# EAGLE design revB (EAGLE 6.3)

## Sheet 1 of 4: MCU
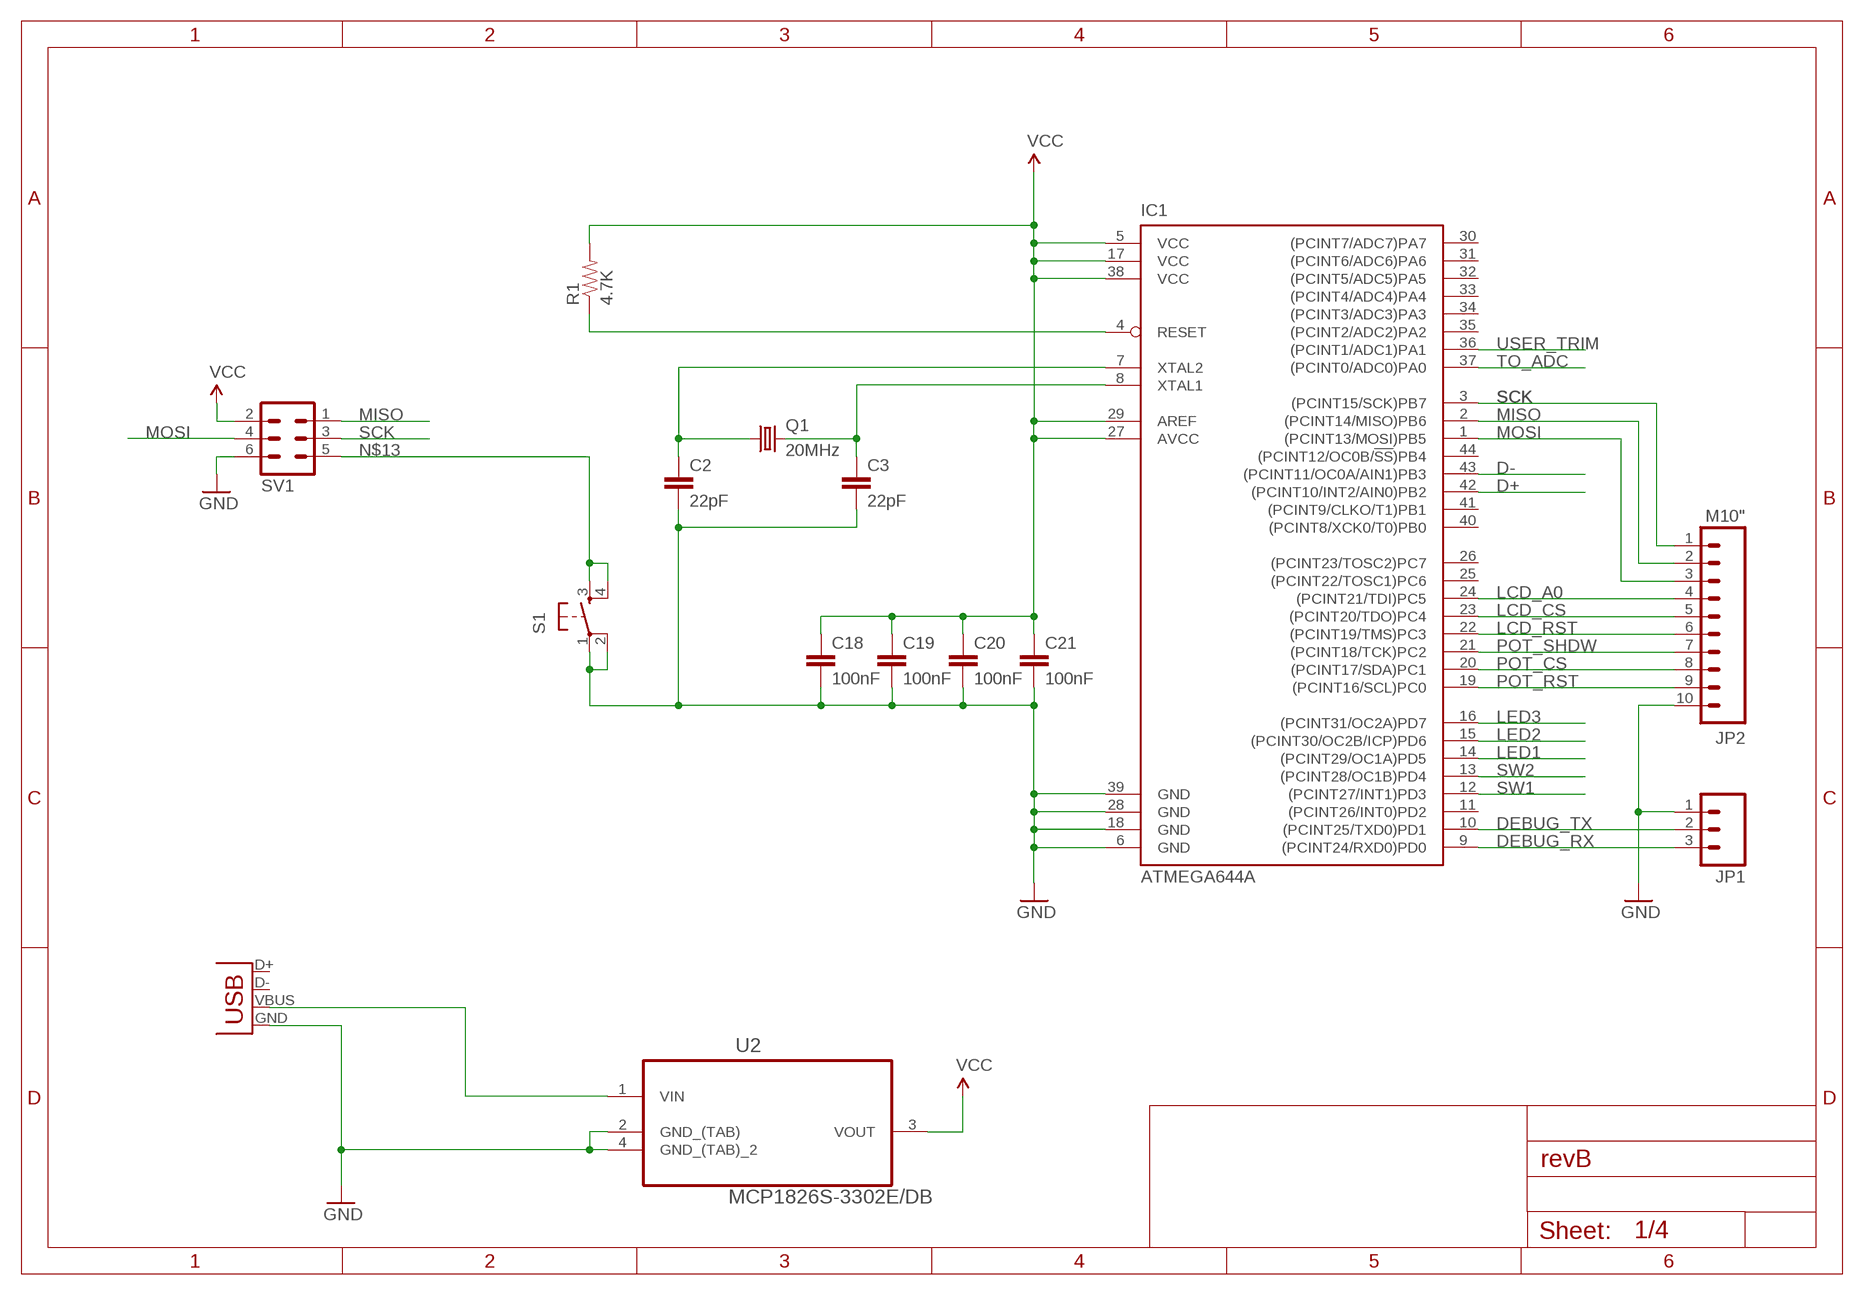
[diagram p0: schematic, sheet 1]

### Parts
C2  22pF  CAP0805  [0805]
C3  22pF  CAP0805  [0805]
C18  100nF  CAP0805  [0805]
C19  100nF  CAP0805  [0805]
C20  100nF  CAP0805  [0805]
C21  100nF  CAP0805  [0805]
IC1  ATMEGA644A  [TQFP44]
JP1  M03PTH  [1X03]
JP2  M10"  [1X10]
Q1  20MHz  CRYSTALHC49UV  [HC49U-V]
R1  4.7K  RESISTOR1206  [1206]
S1  TAC_SWITCHPTH  [TACTILE-PTH]
SV1  MA03-2  [MA03-2]
U2  MCP1826S-3302E/DB  [SOT230P700X180-4N]
X2  USB-MB-H  [USB-MB-H]

### Nets
D+: IC1.42((PCINT10/INT2/AIN0)PB2)
D-: IC1.43((PCINT11/OC0A/AIN1)PB3)
DEBUG_RX: IC1.9((PCINT24/RXD0)PD0) JP1.3
DEBUG_TX: IC1.10((PCINT25/TXD0)PD1) JP1.2
GND: C2.2 C3.2 C18.2 C19.2 C20.2 C21.2 IC1.6(GND) IC1.18(GND) IC1.28(GND) IC1.39(GND) JP1.1 JP2.10 S1.1 S1.2 SV1.6 U2.2(GND_(TAB)) U2.4(GND_(TAB)_2) X2.GND ; also sheet 2,3,4
LCD_A0: IC1.24((PCINT21/TDI)PC5) JP2.4 ; also sheet 3
LCD_CS: IC1.23((PCINT20/TDO)PC4) JP2.5 ; also sheet 3
LCD_RST: IC1.22((PCINT19/TMS)PC3) JP2.6 ; also sheet 3
LED1: IC1.14((PCINT29/OC1A)PD5) ; also sheet 4
LED2: IC1.15((PCINT30/OC2B/ICP)PD6) ; also sheet 4
LED3: IC1.16((PCINT31/OC2A)PD7) ; also sheet 4
MISO: IC1.2((PCINT14/MISO)PB6) JP2.2 SV1.1 ; also sheet 2
MOSI: IC1.1((PCINT13/MOSI)PB5) JP2.3 SV1.4 ; also sheet 2,3
N$1: C3.1 IC1.8(XTAL1) Q1.2
N$2: C2.1 IC1.7(XTAL2) Q1.1
N$13: S1.3 S1.4 SV1.5
N$20: U2.1(VIN) X2.VBUS
POT_CS: IC1.20((PCINT17/SDA)PC1) JP2.8 ; also sheet 2
POT_RST: IC1.19((PCINT16/SCL)PC0) JP2.9 ; also sheet 2
POT_SHDW: IC1.21((PCINT18/TCK)PC2) JP2.7 ; also sheet 2
RESET: IC1.4(RESET) R1.1
SCK: IC1.3((PCINT15/SCK)PB7) JP2.1 SV1.3 ; also sheet 2,3
SW1: IC1.12((PCINT27/INT1)PD3) ; also sheet 4
SW2: IC1.13((PCINT28/OC1B)PD4) ; also sheet 4
TO_ADC: IC1.37((PCINT0/ADC0)PA0) ; also sheet 2
USER_TRIM: IC1.36((PCINT1/ADC1)PA1) ; also sheet 4
VCC: C18.1 C19.1 C20.1 C21.1 IC1.5(VCC) IC1.17(VCC) IC1.27(AVCC) IC1.29(AREF) IC1.38(VCC) R1.2 SV1.2 U2.3(VOUT) ; also sheet 2,3,4
Unconnected: IC1.11((PCINT26/INT0)PD2) IC1.25((PCINT22/TOSC1)PC6) IC1.26((PCINT23/TOSC2)PC7) IC1.30((PCINT7/ADC7)PA7) IC1.31((PCINT6/ADC6)PA6) IC1.32((PCINT5/ADC5)PA5) IC1.33((PCINT4/ADC4)PA4) IC1.34((PCINT3/ADC3)PA3) IC1.35((PCINT2/ADC2)PA2) IC1.40((PCINT8/XCK0/T0)PB0) IC1.41((PCINT9/CLKO/T1)PB1) IC1.44((PCINT12/OC0B/!SS!)PB4) X2.D+ X2.D-

## Sheet 2 of 4: Analogue Input Stage
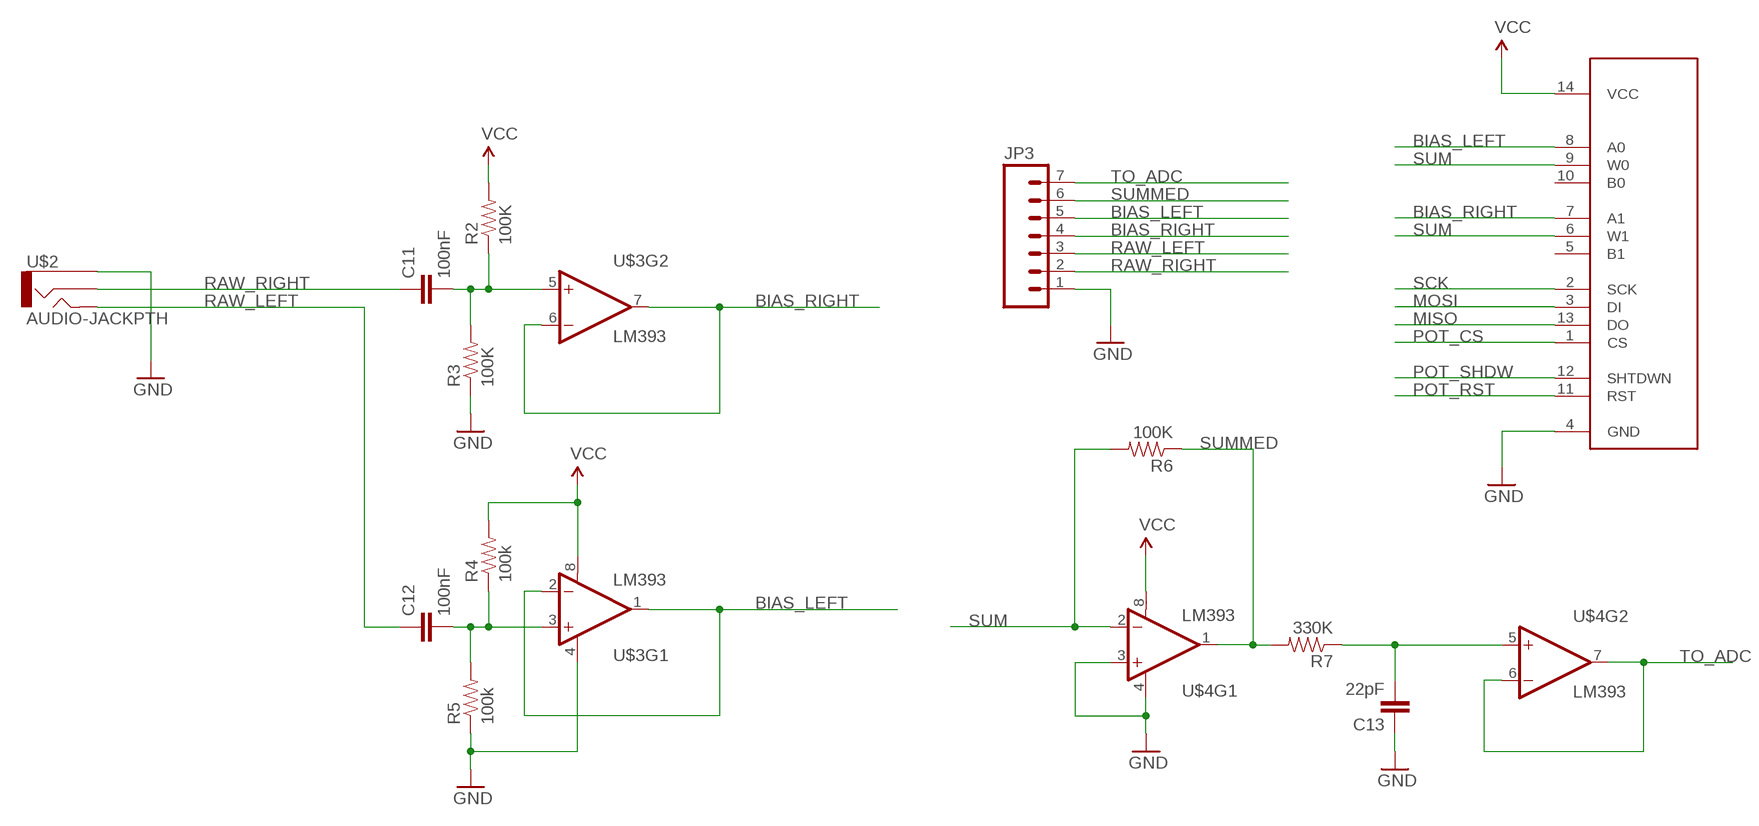
[diagram p1: schematic, sheet 2]

### Parts
C11  100nF  CAP0805  [0805]
C12  100nF  CAP0805  [0805]
C13  22pF  CAP0805  [0805]
JP3  M07  [1X07]
R2  100K  RESISTOR1206  [1206]
R3  100K  RESISTOR1206  [1206]
R4  100k  RESISTOR1206  [1206]
R5  100k  RESISTOR1206  [1206]
R6  100K  RESISTOR1206  [1206]
R7  330K  RESISTOR1206  [1206]
U1  MCP42XXX  [SO014]
U$2  AUDIO-JACKPTH  [AUDIO-JACK]
U$3  LM393  [SO08]
U$4  LM393  [SO08]

### Nets
BIAS_LEFT: JP3.5 U1.8(A0) U$3.1(OUT) U$3.2(-IN)
BIAS_RIGHT: JP3.4 U1.7(A1) U$3.6(-IN) U$3.7(OUT)
GND: C13.1 JP3.1 R3.1 R5.1 U1.4(GND) U$2.1 U$3.4(V-) U$4.3(+IN) U$4.4(V-) ; also sheet 1,3,4
MISO: U1.13(DO) ; also sheet 1
MOSI: U1.3(DI) ; also sheet 1,3
N$15: C11.2 R2.1 R3.2 U$3.5(+IN)
N$16: C12.2 R4.1 R5.2 U$3.3(+IN)
N$17: C13.2 R7.1 U$4.5(+IN)
POT_CS: U1.1(CS) ; also sheet 1
POT_RST: U1.11(RST) ; also sheet 1
POT_SHDW: U1.12(SHTDWN) ; also sheet 1
RAW_LEFT: C12.1 JP3.3 U$2.5
RAW_RIGHT: C11.1 JP3.2 U$2.2
SCK: U1.2(SCK) ; also sheet 1,3
SUM: R6.2 U1.6(W1) U1.9(W0) U$4.2(-IN)
SUMMED: JP3.6 R6.1 R7.2 U$4.1(OUT)
TO_ADC: JP3.7 U$4.6(-IN) U$4.7(OUT) ; also sheet 1
VCC: R2.2 R4.2 U1.14(VCC) U$3.8(V+) U$4.8(V+) ; also sheet 1,3,4
Unconnected: U1.5(B1) U1.10(B0)

## Sheet 3 of 4: Screen
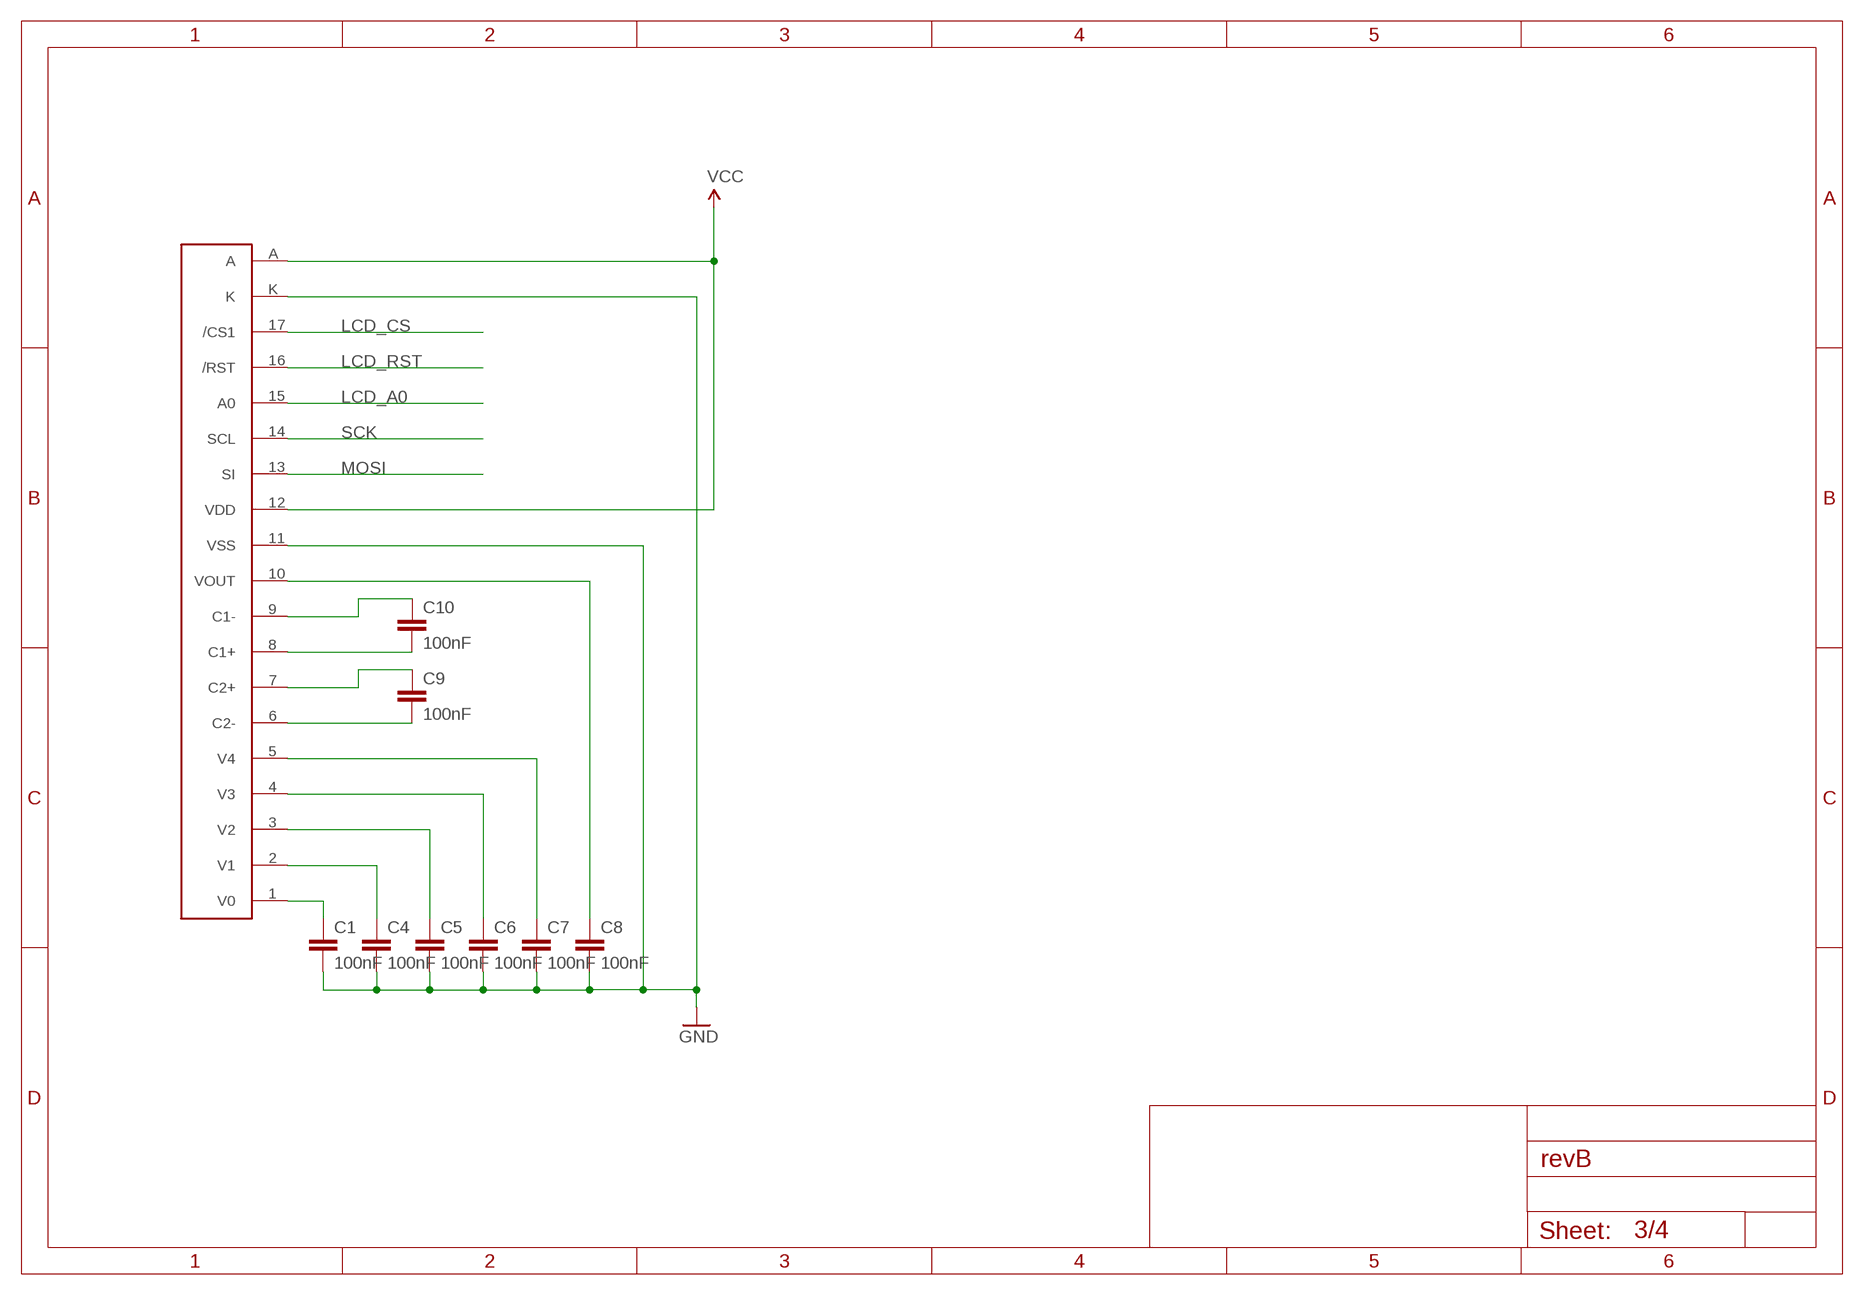
[diagram p2: schematic, sheet 3]

### Parts
C1  100nF  CAP0805  [0805]
C4  100nF  CAP0805  [0805]
C5  100nF  CAP0805  [0805]
C6  100nF  CAP0805  [0805]
C7  100nF  CAP0805  [0805]
C8  100nF  CAP0805  [0805]
C9  100nF  CAP0805  [0805]
C10  100nF  CAP0805  [0805]
U$1  NHD_128X32  [NHD_128X32]

### Nets
GND: C1.2 C4.2 C5.2 C6.2 C7.2 C8.2 U$1.11(VSS) U$1.K ; also sheet 1,2,4
LCD_A0: U$1.15(A0) ; also sheet 1
LCD_CS: U$1.17(/CS1) ; also sheet 1
LCD_RST: U$1.16(/RST) ; also sheet 1
MOSI: U$1.13(SI) ; also sheet 1,2
N$3: C9.2 U$1.6(C2-)
N$4: C9.1 U$1.7(C2+)
N$5: C10.2 U$1.8(C1+)
N$6: C10.1 U$1.9(C1-)
N$7: C1.1 U$1.1(V0)
N$8: C4.1 U$1.2(V1)
N$9: C5.1 U$1.3(V2)
N$10: C6.1 U$1.4(V3)
N$11: C7.1 U$1.5(V4)
N$12: C8.1 U$1.10(VOUT)
SCK: U$1.14(SCL) ; also sheet 1,2
VCC: U$1.12(VDD) U$1.A ; also sheet 1,2,4

## Sheet 4 of 4: MISC
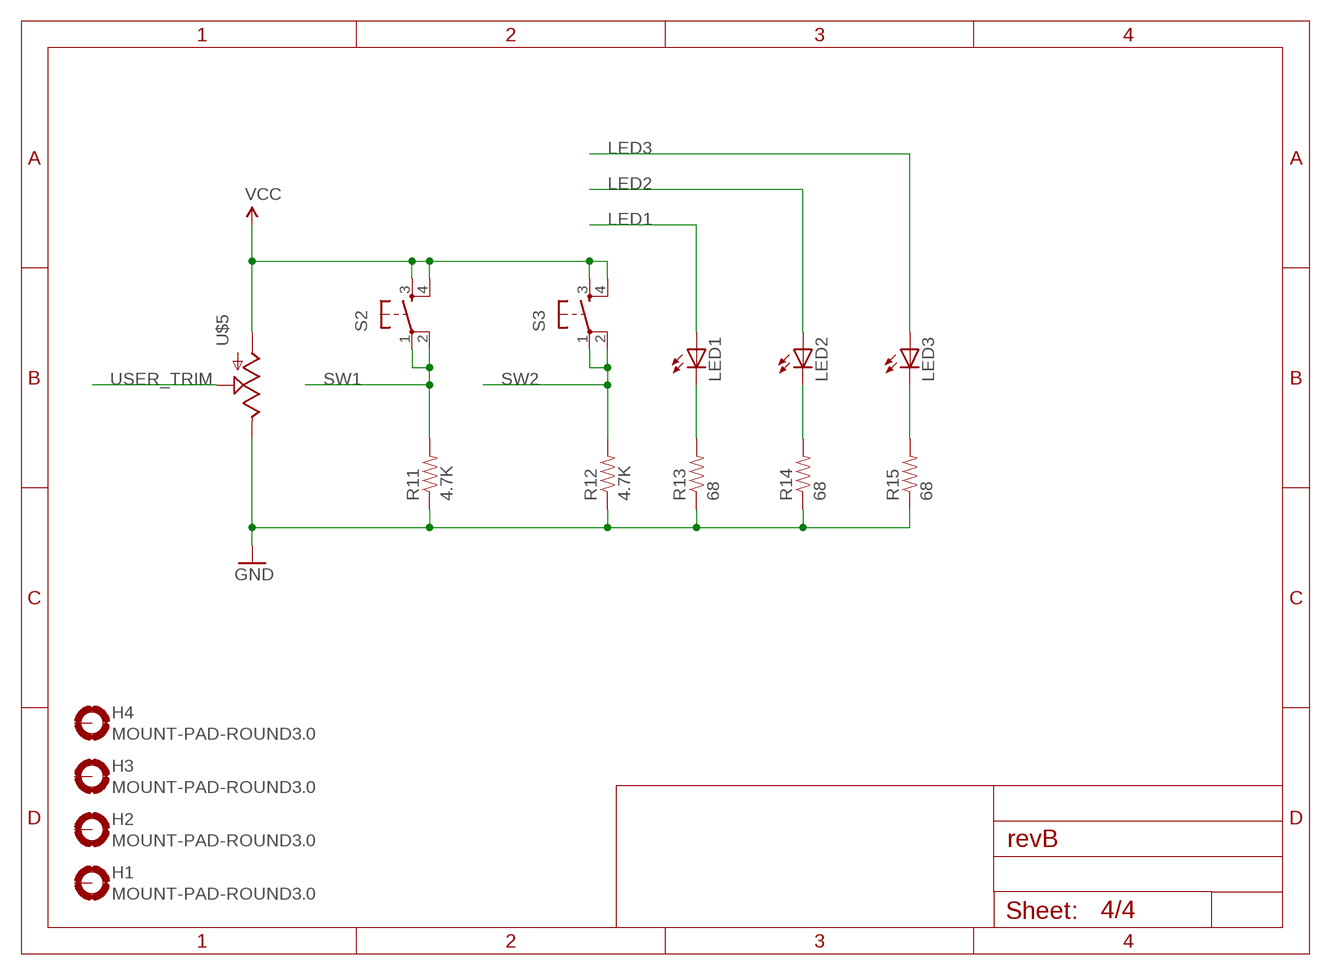
[diagram p3: schematic, sheet 4]

### Parts
H1  MOUNT-PAD-ROUND3.0  [3,0-PAD]
H2  MOUNT-PAD-ROUND3.0  [3,0-PAD]
H3  MOUNT-PAD-ROUND3.0  [3,0-PAD]
H4  MOUNT-PAD-ROUND3.0  [3,0-PAD]
LED1  LED1206  [LED-1206]
LED2  LED1206  [LED-1206]
LED3  LED1206  [LED-1206]
R11  4.7K  RESISTOR1206  [1206]
R12  4.7K  RESISTOR1206  [1206]
R13  68  RESISTOR1206  [1206]
R14  68  RESISTOR1206  [1206]
R15  68  RESISTOR1206  [1206]
S2  TAC_SWITCHPTH  [TACTILE-PTH]
S3  TAC_SWITCHPTH  [TACTILE-PTH]
U$5  POTTRIM  [TRIM_POT]

### Nets
GND: R11.1 R12.1 R13.1 R14.1 R15.1 U$5.2(E) ; also sheet 1,2,3
LED1: LED1.A ; also sheet 1
LED2: LED2.A ; also sheet 1
LED3: LED3.A ; also sheet 1
N$22: LED1.C R13.2
N$23: LED2.C R14.2
N$24: LED3.C R15.2
SW1: R11.2 S2.1 S2.2 ; also sheet 1
SW2: R12.2 S3.1 S3.2 ; also sheet 1
USER_TRIM: U$5.1(S) ; also sheet 1
VCC: S2.3 S2.4 S3.3 S3.4 U$5.3(A) ; also sheet 1,2,3
Unconnected: H1.B3,0(MOUNT) H2.B3,0(MOUNT) H3.B3,0(MOUNT) H4.B3,0(MOUNT)

## Library data of the parts
C1-C13 C18-C21 = SparkFun:CAP: Capacitor Standard 0603 ceramic capacitor, and 0.1" leaded capacitor.
H1-H4 = holes:MOUNT-PAD-ROUND: MOUNTING PAD, round
IC1 = atmel:ATMEGA644: 8-bit Microcontroller with 64K Bytes In-System Programmable Flash Source: http://www.atmel.com/dyn/resources/prod_documents/doc2593.pdf; MPN: ATMEGA644PV-10AU; OC_FARNELL: 1455123; OC_NEWARK: 58M3748
JP1 = SparkFun-Connectors:M03: Header 3 Standard 3-pin 0.1" header. Use with straight break away headers (SKU : PRT-00116), right angle break away headers (PRT-00553), swiss pins (PRT-00743), machine pins (PRT-00117), and female headers (PRT-00115). Molex polarized connector foot print use with SKU : PRT-08232 with associated crimp pins and housings.
JP2 = SparkFun-Connectors:M10: Header 10 Standard 10-pin 0.1" header. Use with straight break away headers (SKU : PRT-00116), right angle break away headers (PRT-00553), swiss pins (PRT-00743), machine pins (PRT-00117), and female headers (PRT-00115).
JP3 = SparkFun-Connectors:M07: Header 7 Standard 7-pin 0.1" header. Use with straight break away headers (SKU : PRT-00116), right angle break away headers (PRT-00553), swiss pins (PRT-00743), machine pins (PRT-00117), and female headers (PRT-00115). NOTES ON THE VARIANTS LOCK and LOCK_LONGPADS... This footprint was designed to help hold the alignment of a through-hole component (i.e. 7-pin header) while soldering it into place. You may notice that each hole has been shifted either up or down by 0.005 of an inch from it's more standard position (which is usually a perfectly straight line). This slight alteration caused the pins (the squares in the middle) to touch the edges of the holes. Because they are alternating, it causes a "brace" to hold the header in place. 0.005 has proven to be the perfect amount of "off-center" position when using our standard breakaway headers. Although looks a little odd when you look at the bare footprint, once you have a header in there, the alteration is very hard to notice. Also, if you push a header all the way into place, it is covered up entirely on the bottom side. This idea of altering the position of holes to aid alignment will be further integrated into the Sparkfun Library for other footprints. It can help hold any component with 3 or more connection pins.
LED1-LED3 = SparkFun:LED: LEDs Standard schematic elements and footprints for 5mm, 3mm, 1206, and 0603 sized LEDs. 5mm - Spark Fun Electronics SKU : COM-00529 (and others)
Q1 = SparkFun:CRYSTAL: Crystals Various standard crystals. Proven footprints. Spark Fun Electronics SKU : COM-00534
R1-R7 R11-R15 = SparkFun:RESISTOR: Resistor Basic schematic elements and footprints for 0603, 1206, and PTH 1/10th watt (small) resistors.
S1-S3 = SparkFun:TAC_SWITCH: Momentary Switch Button commonly used for reset or general input. Spark Fun Electronics SKU : COM-00097
SV1 = con-lstb:MA03-2: PIN HEADER; OC_FARNELL: unknown; OC_NEWARK: unknown
U1 = SparkFun:MCP42XXX
U2 = MCP1826S:MCP1826S-3302E/DB: IC, LDO, 3.3V, 1A; MPN: MCP1826S-3302E/DB; OC_FARNELL: 1578424; OC_NEWARK: 27M0037; PACKAGE: SOT-223-3; SUPPLIER: Microchip
U$1 = newhaven:NHD_128X32
U$2 = SparkFun:AUDIO-JACK: 3.5mm Audio Jack Simple 3.5mm common PCB mount audio jack. SKU: PRT-08032
U$3 U$4 = SparkFun:LM393
U$5 = SparkFun:POT
X2 = SparkFun:USB: USB Connectors USB-B-PTH is fully proven SKU : PRT-00139 USB-miniB is fully proven SKU : PRT-00587 USB-A-PCB is untested. USB-A-H is throughly reviewed, but untested. Spark Fun Electronics SKU : PRT-00437 USB-B-SMT is throughly reviewed, but untested. Needs silkscreen touching up. USB-A-S has not been used/tested USB-MB-H has not been used/tested

## Board
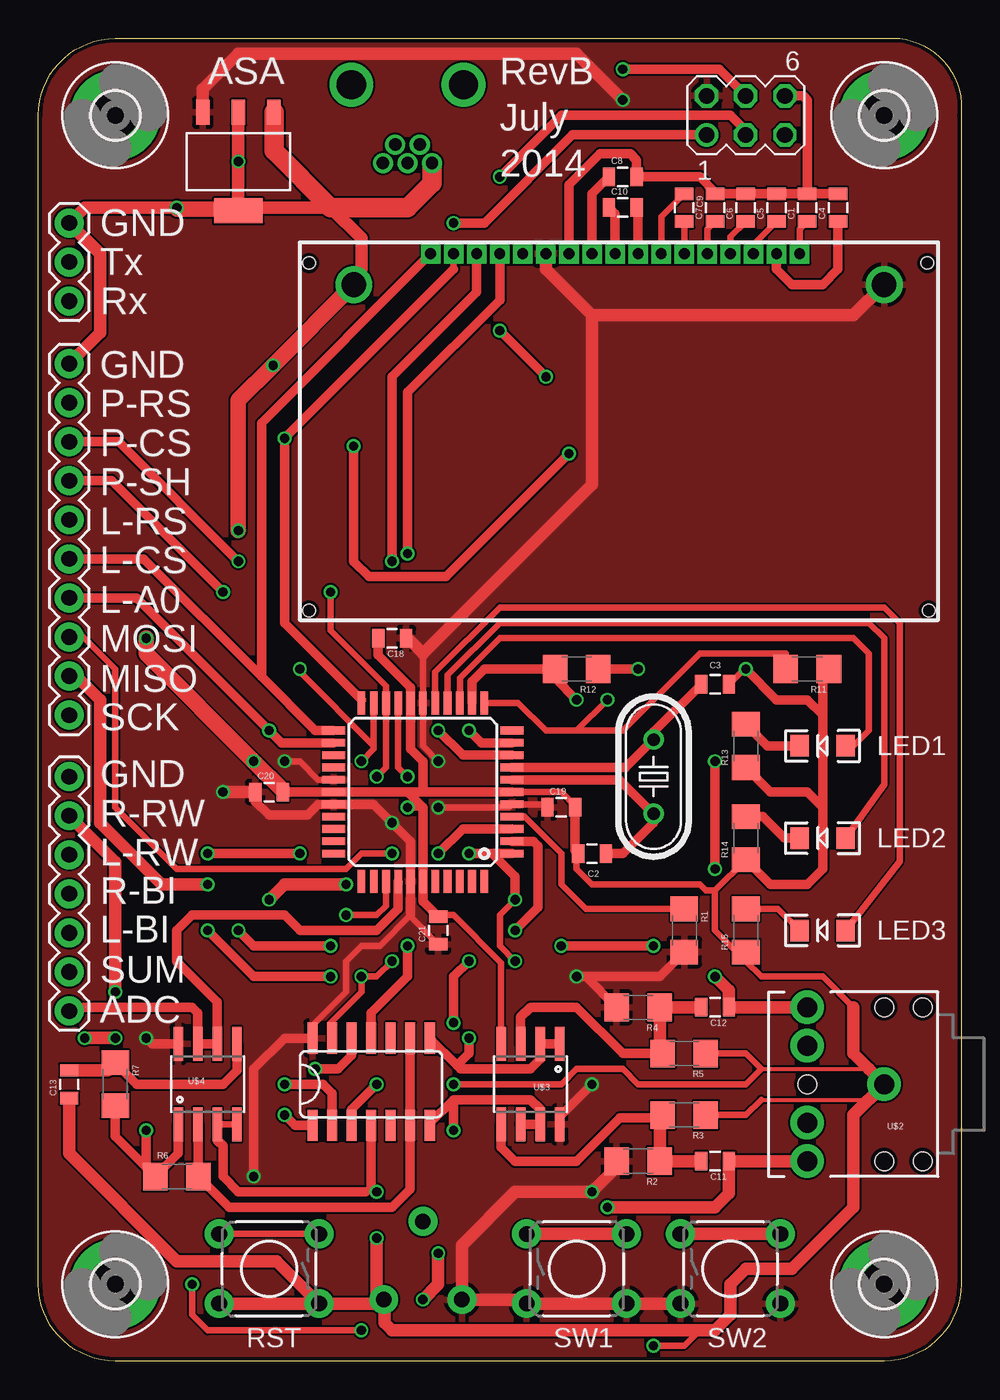
[diagram p4: board, top side]
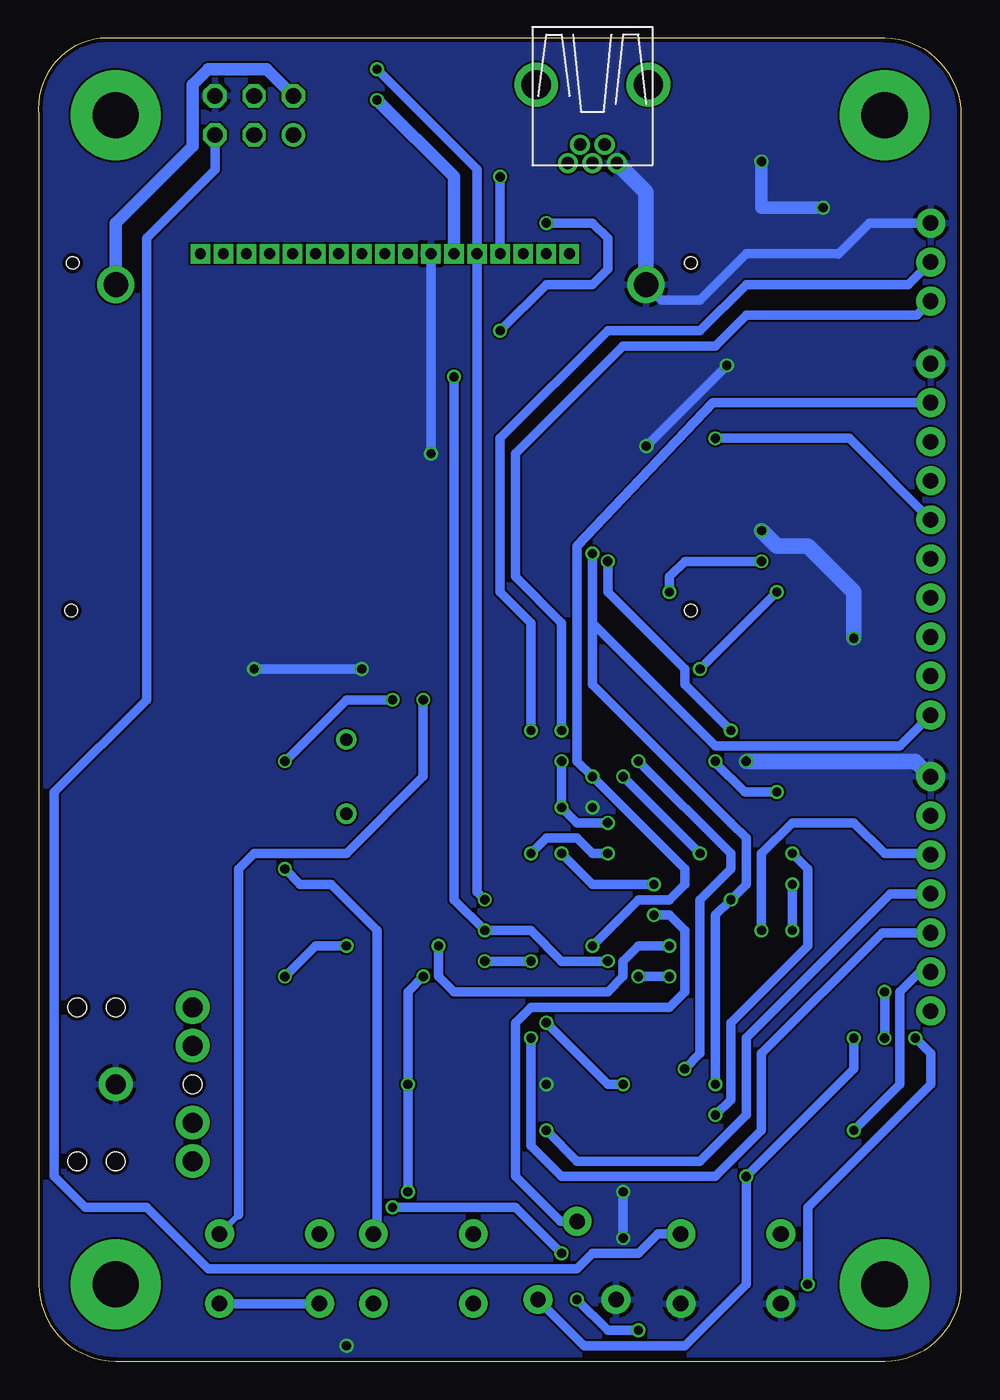
[diagram p5: board, bottom side, seen from below]

Size 60.03 x 86 mm. Coordinates in mm from the lower left corner, seen from the top.
Outline: 0,5 0,81 arc-90 5,86 56,86 arc-90 60,81 60,5 arc-90 55,0 5,0 arc-90 0,5
Copper layers (1*16): Top 0.035mm / dielectric 1.5mm / Bottom 0.035mm
Design rules "dirt_cheap_dirty_boards.v1": minimum track width 5mil, minimum drill 12mil, track to track 5mil, track to pad 5mil, pad to pad 5mil, via to via 5mil, smd to smd 0mil, copper to edge 10mil, drill to drill 10mil, minimum pad ring 10mil, minimum via ring 6mil, stop-mask expansion 2mil, vias tented up to drill 25mil, thermal gap 10mil

### Footprints (pad centres in the part's own frame; a part is rotated, then mirrored left to right if it is on the bottom)
0805 = smd 0.8 x 1.2: 1 -0.9,0; 2 0.9,0
3,0-PAD = drill 3 pad 5.842: B3,0 0,0
TQFP44 = smd 1.5 x 0.5: 1 -5.8,4; 2 -5.8,3.2; 3 -5.8,2.4; 4 -5.8,1.6; 5 -5.8,0.8; 6 -5.8,0; 7 -5.8,-0.8; 8 -5.8,-1.6; 9 -5.8,-2.4; 10 -5.8,-3.2; 11 -5.8,-4; 23 5.8,-4; 24 5.8,-3.2; 25 5.8,-2.4; 26 5.8,-1.6; 27 5.8,-0.8; 28 5.8,0; 29 5.8,0.8; 30 5.8,1.6; 31 5.8,2.4; 32 5.8,3.2; 33 5.8,4 | smd 0.5 x 1.5: 12 -4,-5.8; 13 -3.2,-5.8; 14 -2.4,-5.8; 15 -1.6,-5.8; 16 -0.8,-5.8; 17 0,-5.8; 18 0.8,-5.8; 19 1.6,-5.8; 20 2.4,-5.8; 21 3.2,-5.8; 22 4,-5.8; 34 4,5.8; 35 3.2,5.8; 36 2.4,5.8; 37 1.6,5.8; 38 0.8,5.8; 39 0,5.8; 40 -0.8,5.8; 41 -1.6,5.8; 42 -2.4,5.8; 43 -3.2,5.8; 44 -4,5.8
1X03 = drill 1.016 pad 1.88: 1 0,0; 2 2.54,0; 3 5.08,0
1X10 = drill 1.016 pad 1.88: 1 0,0; 2 2.54,0; 3 5.08,0; 4 7.62,0; 5 10.16,0; 6 12.7,0; 7 15.24,0; 8 17.78,0; 9 20.32,0; 10 22.86,0
1X07 = drill 1.016 pad 1.88: 1 0,0; 2 2.54,0; 3 5.08,0; 4 7.62,0; 5 10.16,0; 6 12.7,0; 7 15.24,0
LED-1206 = smd 1.2 x 1.4: A -1.5,0; C 1.5,0
HC49U-V = drill 0.813: 1 -2.413,0; 2 2.413,0
1206 = smd 1.6 x 1.8: 1 -1.4,0; 2 1.4,0
TACTILE-PTH = drill 1.016 pad 1.88: 1 -3.251,2.261; 2 3.251,2.261; 3 -3.251,-2.261; 4 3.251,-2.261
MA03-2 = drill 1.016: 1 -2.54,-1.27 | drill 1.016 octagon: 2 -2.54,1.27; 3 0,-1.27; 4 0,1.27; 5 2.54,-1.27; 6 2.54,1.27
SO014 = smd 0.66 x 2.032: 1 -3.175,-2.68; 2 -1.905,-2.68; 3 -0.635,-2.68; 4 0.635,-2.68; 5 1.905,-2.68; 6 3.175,-2.68; 7 4.445,-2.68; 8 4.445,2.997; 9 3.175,2.997; 10 1.905,2.997; 11 0.635,2.997; 12 -0.635,2.997; 13 -1.905,2.997; 14 -3.175,2.997
SOT230P700X180-4N = smd 1.626 x 0.889: 1 -3.2,2.311; 2 -3.2,0; 3 -3.2,-2.311 | smd 1.626 x 3.175: 4 3.2,0
NHD_128X32 = drill 0.7 pad 1.27 square: 1 32.5,24; 2 31,24; 3 29.5,24; 4 28,24; 5 26.5,24; 6 25,24; 7 23.5,24; 8 22,24; 9 20.5,24; 10 19,24; 11 17.5,24; 12 16,24; 13 14.5,24; 14 13,24; 15 11.5,24; 16 10,24; 17 8.5,24 | drill 1.6: A 37.999,21.992; K 3.508,21.99 | hole 0.8: 0.6,23.4; 0.6,0.8; 40.9,0.8; 40.8,23.4
AUDIO-JACK = drill 1.3 pad 2.184: 1 0,0; 2 5,5; 3 5,2.5; 4 5,-2.5; 5 5,-5 | hole 1.2: 0,5; -2.5,5; -2.5,-5; 0,-5; 5,0
SO08 = smd 0.61 x 2.21: 1 -1.905,-2.616; 2 -0.635,-2.616; 3 0.635,-2.616; 4 1.905,-2.616; 5 1.905,2.616; 6 0.635,2.616; 7 -0.635,2.616; 8 -1.905,2.616
TRIM_POT = drill 1 pad 1.88: 1 5.08,0; 2 0,2.54; 3 0,-2.54
USB-MB-H = drill 0.8: D+ 5.1,0; D- 3.9,0.8; GND 5.1,-1.6; ID 3.9,-0.8; VBUS 5.1,1.6 | drill 1.9: P$6 0,-3.65; P$7 0,3.65

### Placement (x,y rotation side)
C1  50,75 90 top
C2  36,33 180 top
C3  44,44 0 top
C4  52,75 90 top
C5  48,75 90 top
C6  46,75 90 top
C7  44,75 90 top
C8  38,77 0 top
C9  42,75 270 top
C10  38,75 0 top
C11  44,13 180 top
C12  44,23 180 top
C13  2,18 90 top
C18  23,47 180 top
C19  34,36 0 top
C20  15,37 0 top
C21  26,28 90 top
H1  5,5 0 top
H2  55,5 0 top
H3  5,81 0 top
H4  55,81 0 top
IC1  25,37 180 top
JP1  2,74 270 top
JP2  2,42 90 top
JP3  2,38 270 top
LED1  51,40 180 top
LED2  51,34 180 top
LED3  51,28 180 top
Q1  40,38 90 top
R1  42,28 270 top
R2  39,13 180 top
R3  42,16 180 top
R4  39,23 180 top
R5  42,20 180 top
R6  9,12 0 top
R7  5,18 270 top
R11  50,45 180 top
R12  35,45 180 top
R13  46,40 90 top
R14  46,34 90 top
R15  46,28 90 top
S1  15,6 180 top
S2  35,6 0 top
S3  45,6 0 top
SV1  46,81 0 top
U1  21,18 0 top
U2  13,78 270 top
U$1  17,48 0 top
U$2  55,18 180 top
U$3  32,18 180 top
U$4  11,18 0 top
U$5  25,4 90 top
X2  24,83 270 top

### Tracks (layer width: path | path; a pad name or v marks a point on that pad's centre or on a via)
BIAS_LEFT  (via drill 0.6)
  Top 0.406: U$3.1 33.91,19.91
  Top 0.61: U$3.1 U$3.2 32.63,19.64 32,19 27.44,19 27.22,19.22 | 27.22,19.22 U1.8 | v28,21 28,20 27.22,19.22
  Bottom 0.61: JP3.5 5.16,27.84 13,20 13,15 16,12 26,12 28,14 v28,21
BIAS_RIGHT  (via drill 0.6)
  Top 0.406: U$3.7 32.63,16.36 | U1.7 25.45,15.45
  Top 0.61: U$3.6 U$3.7 | 32.63,16.36 32,17 27,17 | 25.45,15.45 27,17 | v27,15 27,17
  Bottom 0.61: v27,15 25,13 17,13 14,16 14,21 4.62,30.38 JP3.4
DEBUG_RX  (via drill 0.6)
  Top 0.61: IC1.9 27.6,39.4 v26,41
  Bottom 0.61: JP1.3 2.92,68 14,68 16,66 22,66 29,59 29,51 26,48 v26,41
DEBUG_TX  (via drill 0.6)
  Top 0.61: v28,41 28.8,40.2 IC1.10
  Bottom 0.61: JP1.2 3.46,70 14,70 17,67 23,67 30,60 30,50 28,48 v28,41
GND  (via drill 0.6)
  Top 0.254: 47,19 54,19 | 47,17 54,17
  Top 0.406: R5.1 46,20 47,19 46,18 39,18 38,19 35,19 34,18 v27,18 | R3.1 46,16 47,17 | 54,17 U$2.1 | U$4.4 U$4.3 11.63,14.37 | IC1.6 34,37 34.9,36.1 C19.2 | 34.9,33.2 C2.2 35,32.9 35,32 36,31 43,31 43.4,30.6 44,30.6 | U$3.4 30.09,25.91 27,29 26.1,29 C21.2 | C20.2 15.9,37.1 | 21.27,11 21.64,11.37 | C7.2 44,76 | 53,23 51,25 47,25 46,26 R15.1 45.4,26.6 44,28 44,30.6 | 44,30.6 R14.1 | R11.1 51,44.6 | C3.2 45.9,45 v46,45 | v40,1 42,1 43,2 | v24,36 25,36
  Top 0.61: 24,37 IC1.28 C20.2 | 24,37 25,37 | 25,37 IC1.6 | 24,37 25,36 IC1.39 25,29.9 C21.2 | C19.2 34.9,33.2 | R12.1 v39,45 | 21.27,11 13,11 12,12 12,14 11.63,14.37 | 25,37 25,39 24.2,39.8 IC1.18 24.2,43.8 22.1,45.9 C18.2 | U1.4 21.64,11.37 v22,11 | 44,76 43,77 C8.2 38.9,78.1 38.5,78.5 36.5,78.5 34.5,76.5 U$1.11 | C7.2 C6.2 C5.2 C1.2 | C1.2 C4.2 | SV1.6 49.73,82.27 50,82 C1.2 | R14.1 47.6,31 50,31 51,32 51,36 | 51,44.6 51,42 | 51,42 51,36 | R13.1 47.6,37 50,37 51,36 | v46,45 48,43 50,43 51,42 | v34.5,59 26.5,51 21.5,51 20.5,52 v20.5,59.5 | 22.2,3.74 U$5.2 22.5,3.96
  Top 0.813: C13.1 2,13.5 9,6.5 15.49,6.5 S1.1 | JP2.10 4,66.86 4,72 JP1.1 3,75 v9,75 | 13,75 U2.4 9,74.8 v9,75 | 13,75 v13,78 U2.2 | 53,23 53,20 54,19 U$2.1 53,16 53,10 49,6 46,6 45,5 45,3 44,2 43,2 23,2 22.5,2.5 22.5,3.96 | S1.1 S1.2 | S1.1 22.2,3.74 | v22,8 22,4.46 U$5.2 | v9,75 13,75 | 13,75 19,75 21,73 21,71 20,70 21,70
  Top 1.016: v7,47 7,46 v14,39 15.9,37.1 | U$1.K v15.26,64.74 13,62.48 v13,54
  Bottom 0.406: 8.01,71.99 8.02,72 | v15.26,64.74
  Bottom 0.61: v39,45 v46,45 | 8.01,71.99 6,74 JP1.1 | v22,11 v22,8 | 8.02,72 14,72 17,69 19.52,69 U$1.K | v15.26,64.74 v20.5,59.5 | v34.5,59 U$1.11
  Bottom 0.813: v9,75 13,75 v13,78
  Bottom 1.016: U$1.K 20.52,72 20.52,76.02 X2.GND | v7,47 7,50 10,53 12,53 v13,54 | v14,39 3,39 JP3.1
  pour Bottom: -2,-2 -2,88 62,88 62,-2
LCD_A0  (via drill 0.6)
  Top 0.61: IC1.24 15.8,40.2 v15,41 6.38,49.62 JP2.4 | U$1.15 28.5,69.5 23,64 v23,52
  Bottom 0.61: v15,41 18,44 18,45 23,50 v23,52
LCD_CS
  Top 0.61: IC1.23 18,41 14.5,44.5 | JP2.5 6.84,52.16 14.5,44.5 | U$1.17 14.5,61 14.5,44.5
LCD_RST  (via drill 0.6)
  Top 0.406: IC1.22 21,43 | U$1.16 27,71 | v16,60 16,59.5
  Top 0.61: 21,43 16,48 16,59.5 | 27,71 v16,60
  Bottom 0.61: JP2.6 7.3,60 v16,60
LED1
  Top 0.406: IC1.14 27.4,44.4 30,47 53,47 54,46 54,41 53,40 LED1.A
LED2
  Top 0.406: IC1.15 26.6,44.6 30,48 54,48 55,47 55,37.5 LED2.A
LED3
  Top 0.406: IC1.16 25.8,44.8 30,49 55,49 56,48 56,32.5 LED3.A
MISO  (via drill 0.6)
  Top 0.406: U1.13 19,21.09 19,22 21,24 v21,25 22,25 v23,26
  Top 0.61: v11,28 14,25 v19,25 | v27,74 29,74 34.73,79.73 SV1.1 | v33,64 v30,67 | IC1.2 32.2,33.8 32.5,33.5 32.5,29.5 v31,28
  Top 0.813: JP2.2 2.46,44.54 4,43 4,35 8,31 v11,31
  Bottom 0.61: v33,64 33,30 v31,28 28,28 26,26 v23,26 | v11,31 v11,28 | v19,25 v21,25 | v27,74 24,74 23,73 23,71 24,70 27,70 v30,67
MOSI  (via drill 0.6)
  Top 0.406: IC1.1 31,33 | v23,33 21,33 20,32 9,32 5,36 5,45 2.92,47.08 JP2.3 | v31,26 30,27 30,29 v31,30
  Top 0.61: v28,33 29.5,33 | 29.5,33 IC1.1 | U1.3 20.36,16.36 v22,18 | v27,22 27,25 v28,26 | v31,30 31,31.5 29.5,33 | v38,84 44.27,84 SV1.4
  Bottom 0.61: v31,30 31.5,30.5 U$1.13 31.5,77.5 v38,84 | v23,33 24,33 25,34 27,34 v28,33 | v22,18 23,18 v27,22 | v28,26 v31,26
N$1
  Top 0.61: IC1.8 38.19,38.6 Q1.2 40,40.9 C3.1
N$2
  Top 0.61: IC1.7 37.79,37.8 Q1.1 40,35 38,33 C2.1
N$3
  Top 0.406: U$1.6 C9.2
N$4
  Top 0.406: U$1.7 40.5,74.4 C9.1
N$5
  Top 0.406: 39,75 U$1.8 | C10.2 39,74.9
  Top 0.61: 39,74.9 U$1.8
N$6
  Top 0.61: U$1.9 37.5,74.6 C10.1
N$7
  Top 0.406: U$1.1 49.5,73.6 C1.1
N$8
  Top 0.61: U$1.2 48,71 49,70 51,70 52,71 C4.1
N$9
  Top 0.406: U$1.3 46.5,72.6 C5.1
N$10
  Top 0.406: U$1.4 45,73.1 C6.1
N$11
  Top 0.406: U$1.5 43.5,73.6 C7.1
N$12
  Top 0.61: U$1.10 36,75.9 C8.1
N$13
  Top 0.406: S1.3 S1.4
  Bottom 0.61: SV1.5 48.54,77.46 53,73 53,43 59,37 59,12 57,10 53,10 49,6 25,6 24,7 21,7 19.74,8.26 S1.3
N$15
  Top 0.406: 40.4,15.8 R3.2 | 40,13 R2.1
  Top 0.61: 40.4,15.8 37.8,15.8 35,13 31,13 30.09,13.9 U$3.5
  Top 0.813: 40.4,15.8 R2.1 C11.2
N$16
  Top 0.406: 40.4,20.2 R5.2
  Top 0.61: R5.2 38,20 35,23 32,23 31.36,22.36 U$3.3
  Top 0.813: C12.2 R4.1 40.4,20.2
N$17
  Top 0.406: 4.5,18.9 R7.1
  Top 0.61: U$4.5 12.9,18.91 12,18 6.4,18 R7.1
  Top 0.813: C13.2 4.5,18.9
N$20
  Top 0.61: 15.51,81 U2.1
  Top 1.27: X2.VBUS 25.6,76.6 24,75 19,75 15.31,78.69 U2.1
N$22
  Top 0.61: R13.2 47.4,40 LED1.C
N$23
  Top 0.61: R14.2 47.1,35.4 48.5,34 LED2.C
N$24
  Top 0.406: LED3.C 48.1,29.4 R15.2
POT_CS  (via drill 0.6)
  Top 0.406: v22,38 22.6,38.6 IC1.20 22.6,43.9 19,47.5 v19,50
  Top 0.61: U1.1 16.68,15.32 v16,16 | JP2.8 5.22,59.78 v13,52 | v11,33 v17,33
  Bottom 0.61: v16,16 15,17 15,22 10,27 10,32 v11,33 | v17,33 v22,38 | v19,50 19,51 18,52 v13,52
POT_RST  (via drill 0.6)
  Top 0.406: IC1.19 23.4,38.6 v24,38
  Top 0.61: U1.11 21.64,22.64 24,25 v24,27
  Bottom 0.61: JP2.9 16.18,62.32 25,53 25,39 v24,38 18,32 18,31 19,30 21,30 v24,27
POT_SHDW  (via drill 0.6)
  Top 0.406: IC1.21 21.8,40 | 21.8,40 21.8,39.8 v21,39 | v17,45 17,44.8 21.8,40
  Top 0.61: JP2.7 4.76,57.24 v12,50 | v18,19 19.5,19 20.36,19.86 U1.12
  Bottom 0.61: v21,39 15,33 15,32 17,30 17,20 v18,19 | v12,50 v17,45
RAW_LEFT  (via drill 0.6)
  Top 0.61: v19,27 14,27 v13,28 | v40,27 v34,27
  Top 0.813: U$2.5 C12.1 44.9,24.1 v44,25
  Bottom 0.406: 2.08,33 JP3.3
  Bottom 0.61: v19,27 21,27 22,26 22,25 23,24 33,24 34,25 v34,27 | v13,28 13,33 11,35 7,35 5,33 2.08,33 | v40,27 42,27 v44,25
RAW_RIGHT  (via drill 0.6)
  Top 0.406: v21,2 11,2 10,3 v10,5
  Top 0.813: U$2.2 C11.1 44.9,10.9 44,10 v37,10 | v26,7 26,5 v25,4 | v3,21 v5,21 | v5,24 5,32.46 JP3.2
  Bottom 0.61: v37,10 29,10 v26,7 | v25,4 23,2 v21,2 | v10,5 10,10 2,18 2,20 v3,21 | v5,21 v5,24
RESET
  Top 0.406: IC1.4 31.6,35.4 34,33 34,31 35.6,29.4 R1.1
SCK  (via drill 0.6)
  Top 0.61: v26,33 27.6,34.6 IC1.3 | v16,18 18.5,18 19.09,17.41 U1.2 | U$1.14 30,69 24,63 v24,52.5 | SV1.3 46,80 45,81 34,81 v30,77
  Top 0.813: v20,31 16,31 v15,30
  Bottom 0.61: v30,77 U$1.14 | JP2.1 4,40 16,40 24,48 | v20,31 24,31 v26,33 | v16,18 16,29 v15,30 14,31 14,34 15,35 24,44 24,48 | v24,52.5 24,49 24,48
SUM
  Top 0.406: 10.4,15.35 U$4.2
  Top 0.61: U1.9 U1.6 24.18,11.18 23,10 12.4,10 R6.2 10.4,15.35
SUMMED  (via drill 0.6)
  Top 0.406: 7,12.6 R6.1
  Top 0.61: U$4.1 9.1,13.49 R6.1 5,14.6 R7.2 | v7,15 7,12.6
  Bottom 0.61: JP3.6 2.7,25.3 4,24 4,18 v7,15
SW1  (via drill 0.6)
  Top 0.406: R11.2 48.6,46 43,46 38,41 35,41 | IC1.12 31.2,42.8 33,41 35,41 | v37,43 35,41
  Top 0.61: v44,32 v44,39
  Top 0.813: S2.1 S2.2
  Bottom 0.406: 38,8.51 S2.2
  Bottom 0.61: S2.2 38.25,7.75 | v37,43 40,43 v44,39 | 38,8.51 38,28 41,31 43,31 v44,32
SW2  (via drill 0.6)
  Top 0.406: R12.2 33.6,44.4
  Top 0.61: IC1.13 28.2,44.2 29,45 R12.2 | 33.6,44.4 v35,43
  Top 0.813: S3.1 S3.2
  Bottom 0.406: 47,9.51 S3.2
  Bottom 0.61: v35,43 35,38 40,33 46,33 47,32 47,9.51
TO_ADC
  Top 0.61: IC1.37 23.4,29.4 22,28 17,28 16,29 10,29 9,28 9,26 11.63,23.36 U$4.6 U$4.7 10.37,22.64 10,23 2.24,23 JP3.7
USER_TRIM  (via drill 0.6)
  Top 0.406: IC1.36 22.6,29.6 22,29 v20,29
  Bottom 0.61: U$5.1 26.08,9.08 29,12 29,22 28,23 19,23 18,24 18,28 19,29 v20,29
VCC  (via drill 0.6)
  Top 0.406: U$3.8 33.91,15.9 | R2.2 37.6,12.6 | 25,46 24.95,45.95 25,45.9 IC1.17 25,40 v26,39 | v26,36 30.6,36 IC1.5 32.9,36.2 C19.1 | C21.1 24.2,28.9 24.2,29 22.2,27 21,27 20,26 20,24 17.82,21.82 U1.14 | IC1.27 18.2,37.8 17,39 v16,39 | 14,37 14.1,36.9 C20.1 | C18.1 24,47 | U$1.A | 35.6,25 v35,25
  Top 0.61: 33.91,15.9 v36,18 | 24.2,29 IC1.38 24.2,33.8 v23,35 21.8,36.2 IC1.29 18.2,36.2 17.5,35.5 15,35.5 14.1,36.4 14.1,36.9 | U$4.8 7.38,20.62 v7,21 | U1.14 16,21 14,19 v14,12 | v35,25 40.4,25 R1.2 | R4.2 35.6,25
  Top 0.813: S3.3 S2.4 S2.3 31.49,4 U$5.3 27.54,7.54 31,11 v36,11 37.6,12.6 | C20.1 v12,37 | 24,47 25,46 36,57 36,68 | U$1.12 33,71 36,68 | 36,68 53,68 U$1.A | U2.3 10.69,82.69 13,85 35,85 v38,82
  Bottom 0.406: v16,39 16,38.9
  Bottom 0.61: v36,11 v36,18 36,24 v35,25 | S3.3 S3.4 | U$5.3 24.54,1 18,1 14,5 v14,12 7,19 v7,21 | v26,39 v26,36 25,35 v23,35 | 16,38.9 C20.1 v12,37
  Bottom 0.813: v38,82 33,77 U$1.12 | U$1.A 55,74 50,79 50,83 49,84 45.19,84 SV1.2
  pour Top: -1,-1 -1,87 61,87 61,-1

### Text on the board
tPlace: ASA | RevB | July | 2014 | GND | Tx | Rx | GND | P-RS | P-CS | P-SH | L-RS | L-CS | L-A0 | MOSI | MISO | SCK | LED1 | GND | R-RW | LED2 | L-RW | R-BI | L-BI | LED3 | SUM | ADC | RST | SW1 | SW2